# EAGLE design Orders (EAGLE 9.5.2)
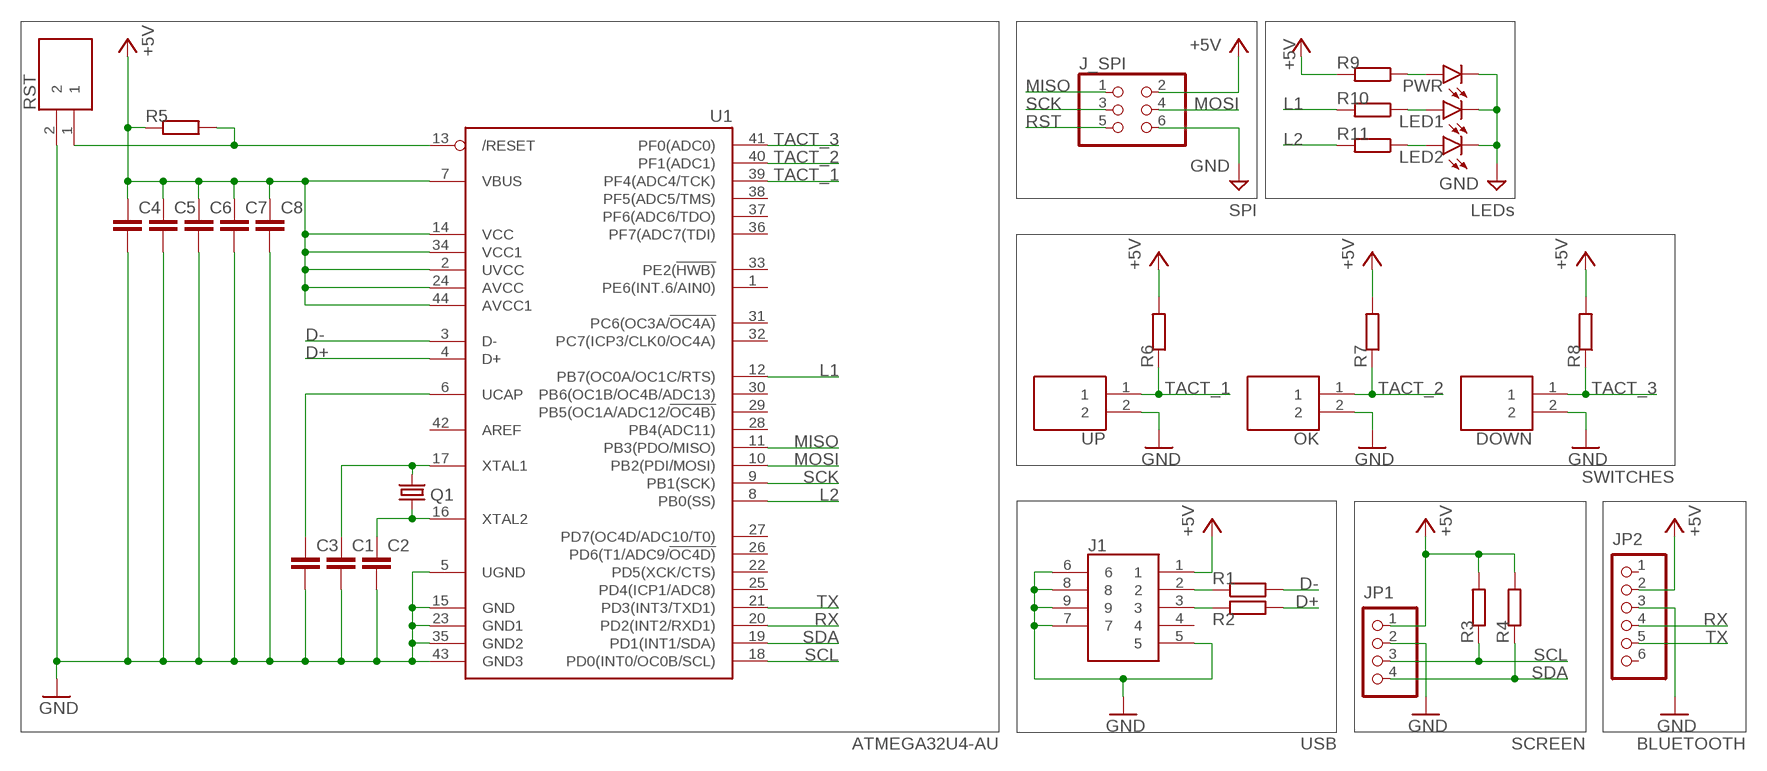
[diagram p0: schematic, sheet 1]

## Parts
C1  C-EUC1206  [C1206]
C2  C-EUC1206  [C1206]
C3  C-EUC1206  [C1206]
C4  C-EUC1206  [C1206]
C5  C-EUC1206  [C1206]
C6  C-EUC1206  [C1206]
C7  C-EUC1206  [C1206]
C8  C-EUC1206  [C1206]
DOWN  KSR231GLFS  [KSR]
J1  10104111-0001LF  [101041110001LF]
J_SPI  PINHD-2X3  [2X03]
JP1  PINHD-1X4  [1X04]
JP2  PINHD-1X6  [1X06]
LED1  LED3MM  [LED3MM]
LED2  LED3MM  [LED3MM]
OK  KSR231GLFS  [KSR]
PWR  LED3MM  [LED3MM]
Q1  CRYSTALHC49UP  [HC49UP]
R1  R-EU_R1206  [R1206]
R2  R-EU_R1206  [R1206]
R3  R-EU_R1206  [R1206]
R4  R-EU_R1206  [R1206]
R5  R-EU_R1206  [R1206]
R6  R-EU_R1206  [R1206]
R7  R-EU_R1206  [R1206]
R8  R-EU_R1206  [R1206]
R9  R-EU_R1206  [R1206]
R10  R-EU_R1206  [R1206]
R11  R-EU_R1206  [R1206]
RST  KSR231GLFS  [KSR]
U1  ATMEGA32U4-AU  [TQFP44]
UP  KSR231GLFS  [KSR]

## Nets
+5V: C4.1 C5.1 C6.1 C7.1 C8.1 J1.1 J_SPI.2 JP1.1 JP2.2 R3.2 R4.2 R5.1 R6.2 R7.2 R8.2 R9.2 U1.2(UVCC) U1.7(VBUS) U1.14(VCC) U1.24(AVCC) U1.34(VCC1) U1.44(AVCC1)
D+: R2.2 U1.4(D+)
D-: R1.2 U1.3(D-)
GND: C1.2 C2.2 C3.2 C4.2 C5.2 C6.2 C7.2 C8.2 DOWN.2 J1.5 J1.6 J1.7 J1.8 J1.9 J_SPI.6 JP1.2 JP2.3 LED1.K(C) LED2.K(C) OK.2 PWR.K(C) RST.2 U1.5(UGND) U1.15(GND) U1.23(GND1) U1.35(GND2) U1.43(GND3) UP.2
L1: R10.2 U1.12(PB7(OC0A/OC1C/RTS))
L2: R11.2 U1.8(PB0(SS))
MISO: J_SPI.1 U1.11(PB3(PDO/MISO))
MOSI: J_SPI.4 U1.10(PB2(PDI/MOSI))
N$1: J1.2 R1.1
N$2: J1.3 R2.1
N$3: C1.1 Q1.2 U1.17(XTAL1)
N$4: C2.1 Q1.1 U1.16(XTAL2)
N$5: PWR.A R9.1
N$6: LED1.A R10.1
N$7: LED2.A R11.1
RST: J_SPI.5 R5.2 RST.1 U1.13(/RESET)
RX: JP2.4 U1.20(PD2(INT2/RXD1))
SCK: J_SPI.3 U1.9(PB1(SCK))
SCL: JP1.3 R3.1 U1.18(PD0(INT0/OC0B/SCL))
SDA: JP1.4 R4.1 U1.19(PD1(INT1/SDA))
TACT_1: R6.1 U1.39(PF4(ADC4/TCK)) UP.1
TACT_2: OK.1 R7.1 U1.40(PF1(ADC1))
TACT_3: DOWN.1 R8.1 U1.41(PF0(ADC0))
TX: JP2.5 U1.21(PD3(INT3/TXD1))
UCAP: C3.1 U1.6(UCAP)
Unconnected: J1.4 JP2.1 JP2.6 U1.1(PE6(INT.6/AIN0)) U1.22(PD5(XCK/CTS)) U1.25(PD4(ICP1/ADC8)) U1.26(PD6(T1/ADC9/!OC4D)) U1.27(PD7(OC4D/ADC10/T0)) U1.28(PB4(ADC11)) U1.29(PB5(OC1A/ADC12/!OC4B)) U1.30(PB6(OC1B/OC4B/ADC13)) U1.31(PC6(OC3A/!OC4A)) U1.32(PC7(ICP3/CLK0/OC4A)) U1.33(PE2(!HWB)) U1.36(PF7(ADC7(TDI)) U1.37(PF6(ADC6/TDO)) U1.38(PF5(ADC5/TMS)) U1.42(AREF)

## Notes on the sheet
- SPI | LEDs
- SWITCHES
- USB | SCREEN | BLUETOOTH

## Library data of the parts
C1-C8 = rcl:C-EU: CAPACITOR, European symbol; SPICEPREFIX: C
DOWN OK RST UP = Switch:KSR231GLFS: Switch Tactile SMT gull wing 3.0N silver IP50 Tactile Switch, SPST-NO 50 mA dc 0.75mm Source: Datasheet <https://componentsearchengine.com/Datasheets/1/KSR231GLFS.pdf>; DESCRIPTION: Switch Tactile SMT gull wing 3.0N silver IP50 Tactile Switch, SPST-NO 50 mA dc 0.75mm; HEIGHT: mm; MANUFACTURER_NAME: C & K COMPONENTS; MANUFACTURER_PART_NUMBER: KSR231GLFS; MOUSER_PART_NUMBER: 611-KSR231GLFS; MOUSER_PRICE-STOCK: https://www.mouser.com/Search/Refine.aspx?Keyword=611-KSR231GLFS; RS_PART_NUMBER: 7931673P; RS_PRICE-STOCK: http://uk.rs-online.com/web/p/products/7931673P
J1 = USB:10104111-0001LF: USB Connectors 5P Quick Connect MicroUSB TypeAB Rcpt Source: Datasheet <https://cdn.amphenol-icc.com/media/wysiwyg/files/drawing/10104111.pdf>; ALLIED_NUMBER: 70236825; ALLIED_PRICE-STOCK: https://www.alliedelec.com/amphenolfci-10104111-0001lf/70236825/; DESCRIPTION: USB Connectors 5P Quick Connect MicroUSB TypeAB Rcpt; HEIGHT: 3.07mm; MANUFACTURER_NAME: Amphenol; MANUFACTURER_PART_NUMBER: 10104111-0001LF; MOUSER_PART_NUMBER: 649-10104111-0001LF; MOUSER_PRICE-STOCK: https://www.mouser.com/Search/Refine.aspx?Keyword=649-10104111-0001LF; RS_PART_NUMBER: 7142353; RS_PRICE-STOCK: http://uk.rs-online.com/web/p/products/7142353
J_SPI = pinhead:PINHD-2X3: PIN HEADER
JP1 = pinhead:PINHD-1X4: PIN HEADER
JP2 = pinhead:PINHD-1X6: PIN HEADER
LED1 LED2 PWR = led:LED: LED OSRAM: - CHIPLED LG R971, LG N971, LY N971, LG Q971, LY Q971, LO R971, LY R971 LH N974, LH R974 LS Q976, LO Q976, LY Q976 LO Q996 - Hyper CHIPLED LW Q18S LB Q993, LB Q99A, LB R99A - SideLED LS A670, LO A670, LY A670, LG A670, LP A670 LB A673, LV A673, LT A673, LW A673 LH A674 LY A675 LS A676, LA A676, LO A676, LY A676, LW A676 LS A679, LY A679, LG A679 - Hyper Micro SIDELED® LS Y876, LA Y876, LO Y876, LY Y876 LT Y87S - SmartLED LW L88C, LW L88S LB L89C, LB L89S, LG L890 LS L89K, LO L89K, LY L89K LS L896, LA L896, LO L896, LY L896 - TOPLED LS T670, LO T670, LY T670, LG T670, LP T670 LSG T670, LSP T670, LSY T670, LOP T670, LYG T670 LG T671, LOG T671, LSG T671 LB T673, LV T673, LT T673, LW T673 LH T674 LS T676, LA T676, LO T676, LY T676, LB T676, LH T676, LSB T676, LW T676 LB T67C, LV T67C, LT T67C, LS T67K, LO T67K, LY T67K, LW E67C LS E67B, LA E67B, LO E67B, LY E67B, LB E67C, LV E67C, LT E67C LW T67C LS T679, LY T679, LG T679 LS T770, LO T770, LY T770, LG T770, LP T770 LB T773, LV T773, LT T773, LW T773 LH T774 LS E675, LA E675, LY E675, LS T675 LS T776, LA T776, LO T776, LY T776, LB T776 LHGB T686 LT T68C, LB T68C - Hyper Mini TOPLED® LB M676 - Mini TOPLED Santana® LG M470 LS M47K, LO M47K, LY M47K Source: http://www.osram.convergy.de LUXEON: - LUMILED® LXK2-PW12-R00, LXK2-PW12-S00, LXK2-PW14-U00, LXK2-PW14-V00 LXK2-PM12-R00, LXK2-PM12-S00, LXK2-PM14-U00 LXK2-PE12-Q00, LXK2-PE12-R00, LXK2-PE12-S00, LXK2-PE14-T00, LXK2-PE14-U00 LXK2-PB12-K00, LXK2-PB12-L00, LXK2-PB12-M00, LXK2-PB14-N00, LXK2-PB14-P00, LXK2-PB14-Q00 LXK2-PR12-L00, LXK2-PR12-M00, LXK2-PR14-Q00, LXK2-PR14-R00 LXK2-PD12-Q00, LXK2-PD12-R00, LXK2-PD12-S00 LXK2-PH12-R00, LXK2-PH12-S00 LXK2-PL12-P00, LXK2-PL12-Q00, LXK2-PL12-R00 Source: www.luxeon.com KINGBRIGHT: KA-3528ASYC Source: www.kingbright.com
Q1 = adafruit:CRYSTAL: CRYSTAL; OC_FARNELL: unknown; OC_NEWARK: unknown
R1-R11 = rcl:R-EU_: RESISTOR, European symbol; SPICEPREFIX: R
U1 = adafruit:ATMEGA32U4: http://www.ladyada.net/library/eagle

## Board
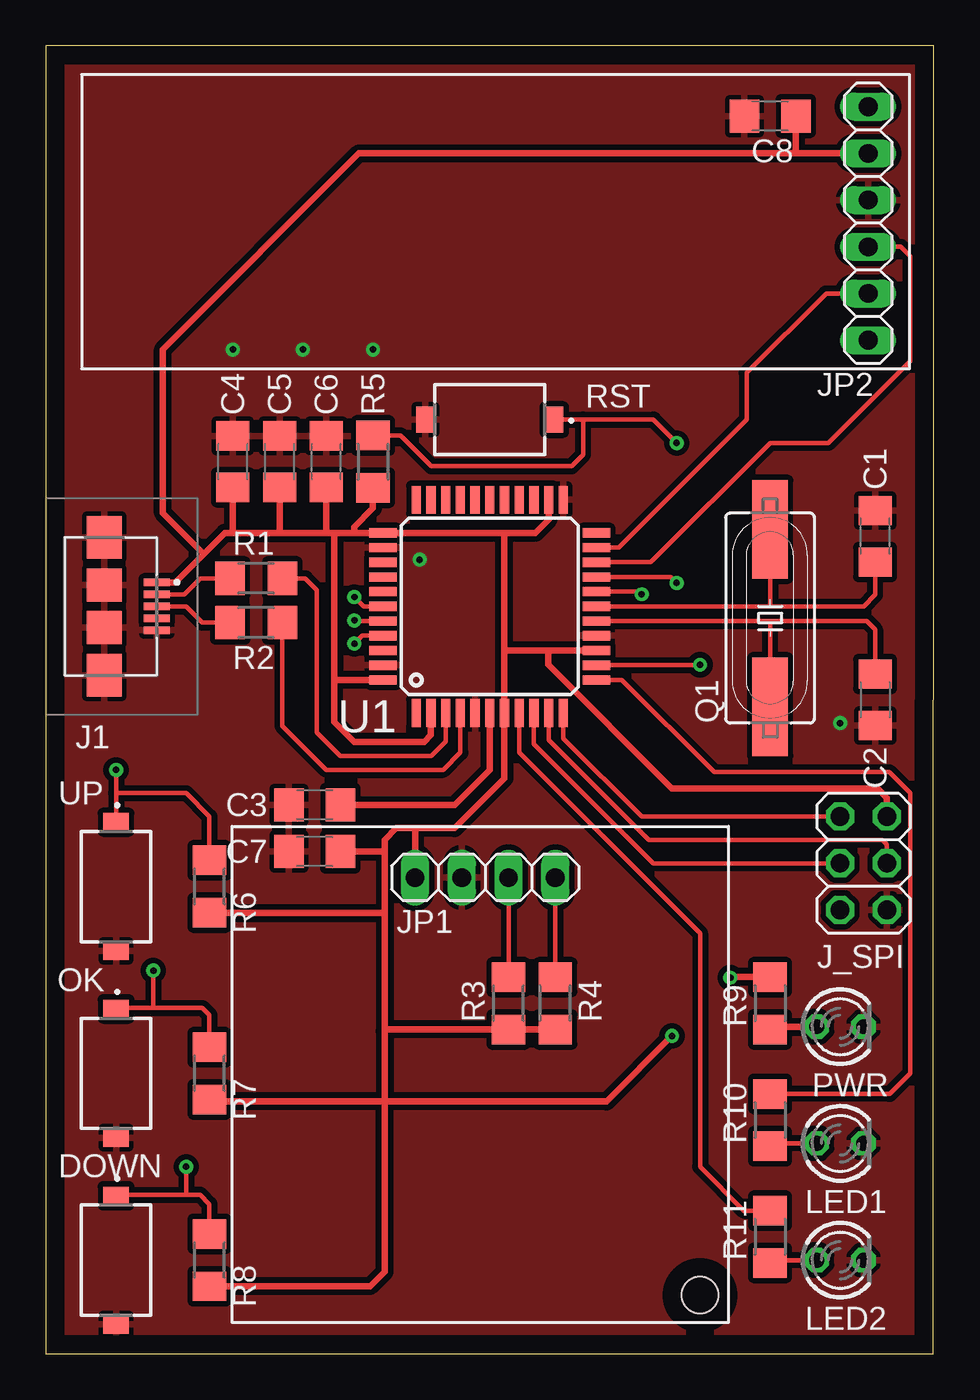
[diagram p1: board, top side]
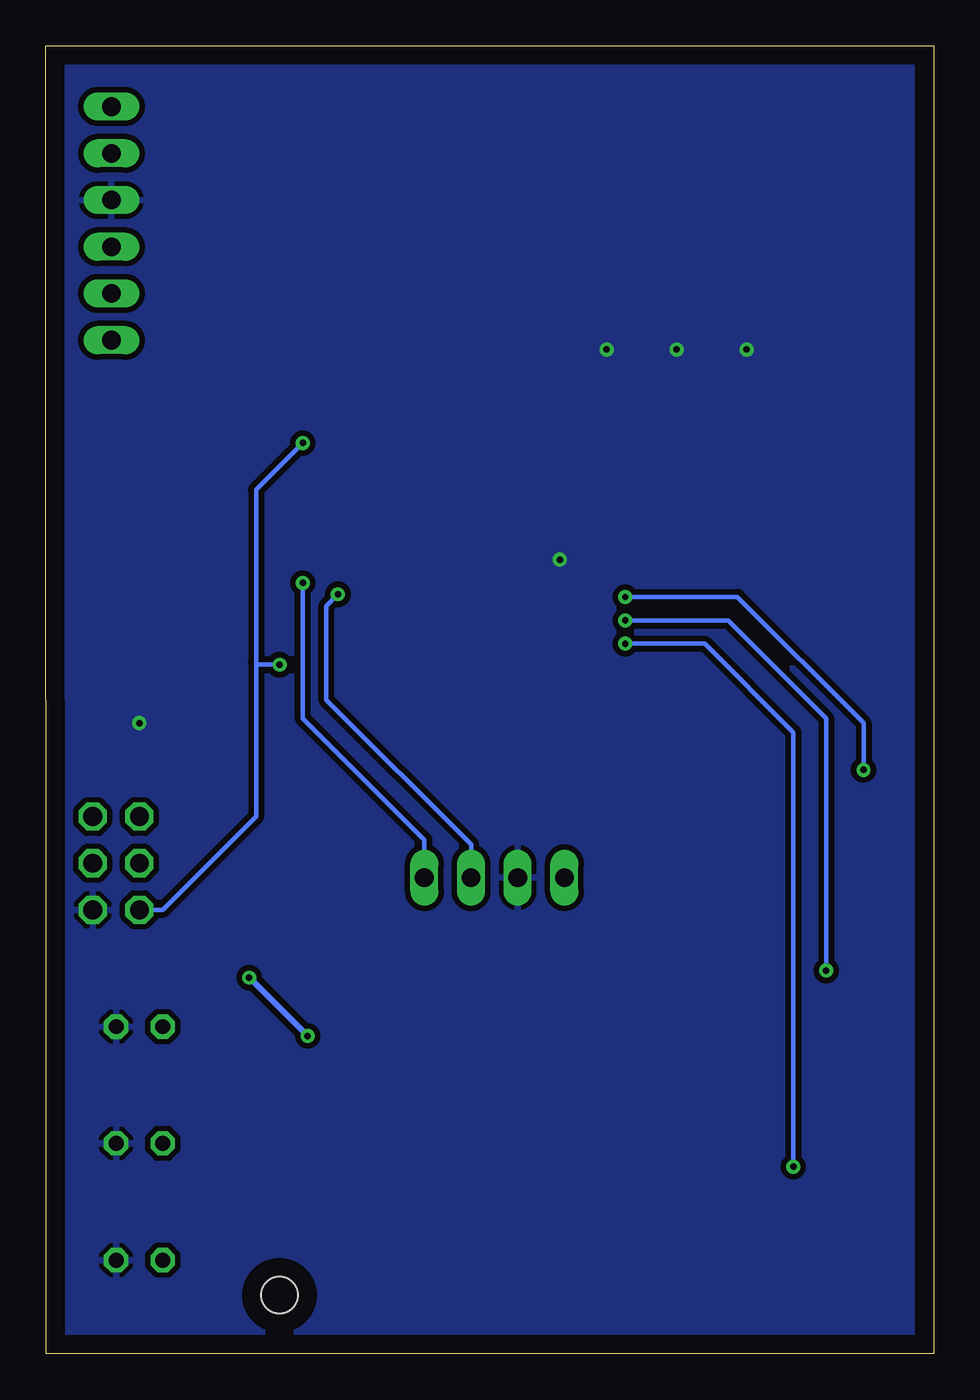
[diagram p2: board, bottom side, seen from below]

Size 48.26 x 71.12 mm. Coordinates in mm from the lower left corner, seen from the top.
Outline: 0,0 48.24,0 48.26,71.12 0,71.12 0,0
Copper layers (1*16): Top 0.035mm / dielectric 1.5mm / Bottom 0.035mm
Design rules "default": minimum track width 6mil, minimum drill 0.35mm, track to track 6mil, track to pad 6mil, pad to pad 6mil, via to via 6mil, smd to smd 6mil, copper to edge 40mil, drill to drill 6mil, minimum pad ring 10mil, minimum via ring 8mil, stop-mask expansion 4mil, vias tented up to drill 0mil, thermal gap 10mil
Holes 2 mm at 35.56,3.17

### Footprints (pad centres in the part's own frame; a part is rotated, then mirrored left to right if it is on the bottom)
C1206 = smd 1.6 x 1.8: 1 -1.4,0; 2 1.4,0
KSR = smd 1 x 1.4: 1 -3.5,0; 2 3.5,0
101041110001LF = smd 0.4 x 1.4: 1 -1.3,5; 2 -0.65,5; 3 0,5; 4 0.65,5; 5 1.3,5 | smd 2.3 x 1.9: 6 -3.75,2.15; 7 3.75,2.15 | smd 1.8 x 1.9: 8 -1.15,2.15; 9 1.15,2.15
2X03 = drill 1.016 octagon: 1 -2.54,-1.27; 2 -2.54,1.27; 3 0,-1.27; 4 0,1.27; 5 2.54,-1.27; 6 2.54,1.27
1X04 = drill 1.016 long: 1 -3.81,0; 2 -1.27,0; 3 1.27,0; 4 3.81,0
1X06 = drill 1.016 long: 1 -6.35,0; 2 -3.81,0; 3 -1.27,0; 4 1.27,0; 5 3.81,0; 6 6.35,0
LED3MM = drill 0.813 octagon: A -1.27,0; K 1.27,0
HC49UP = smd 5.334 x 1.93: 1 -4.826,0; 2 4.826,0
R1206 = smd 1.6 x 1.803: 1 -1.422,0; 2 1.422,0
TQFP44 = smd 1.5 x 0.5: 1 -5.8,4; 2 -5.8,3.2; 3 -5.8,2.4; 4 -5.8,1.6; 5 -5.8,0.8; 6 -5.8,0; 7 -5.8,-0.8; 8 -5.8,-1.6; 9 -5.8,-2.4; 10 -5.8,-3.2; 11 -5.8,-4; 23 5.8,-4; 24 5.8,-3.2; 25 5.8,-2.4; 26 5.8,-1.6; 27 5.8,-0.8; 28 5.8,0; 29 5.8,0.8; 30 5.8,1.6; 31 5.8,2.4; 32 5.8,3.2; 33 5.8,4 | smd 0.5 x 1.5: 12 -4,-5.8; 13 -3.2,-5.8; 14 -2.4,-5.8; 15 -1.6,-5.8; 16 -0.8,-5.8; 17 0,-5.8; 18 0.8,-5.8; 19 1.6,-5.8; 20 2.4,-5.8; 21 3.2,-5.8; 22 4,-5.8; 34 4,5.8; 35 3.2,5.8; 36 2.4,5.8; 37 1.6,5.8; 38 0.8,5.8; 39 0,5.8; 40 -0.8,5.8; 41 -1.6,5.8; 42 -2.4,5.8; 43 -3.2,5.8; 44 -4,5.8

### Placement (x,y rotation side)
C1  45.09,44.45 90 top
C2  45.09,35.56 270 top
C3  14.61,29.84 180 top
C4  10.16,48.51 90 top
C5  12.7,48.51 90 top
C6  15.24,48.51 90 top
C7  14.61,27.3 180 top
C8  39.37,67.31 180 top
DOWN  3.81,5.08 270 top
J1  1.02,40.64 270 top
J_SPI  44.45,26.67 270 top
JP1  23.88,25.89 0 top
JP2  44.7,61.47 270 top
LED1  43.18,11.43 0 top
LED2  43.18,5.08 0 top
OK  3.81,15.24 270 top
PWR  43.18,17.78 0 top
Q1  39.37,40.01 90 top
R1  11.43,42.16 0 top
R2  11.43,39.75 0 top
R3  25.15,19.05 270 top
R4  27.69,19.05 270 top
R5  17.78,48.51 90 top
R6  8.89,25.4 270 top
R7  8.89,15.24 270 top
R8  8.89,5.08 270 top
R9  39.37,19.05 90 top
R10  39.37,12.7 90 top
R11  39.37,6.35 90 top
RST  24.13,50.8 180 top
U1  24.13,40.64 90 top
UP  3.81,25.4 270 top

### Tracks (layer width: path | path; a pad name or v marks a point on that pad's centre or on a via)
+5V  (via drill 0.35)
  Top 0.356: J1.1 7.01,41.94 8.57,43.5 | 10.16,44.64 9.71,44.64 8.57,43.5 | 10.16,44.64 12.7,44.64 | 12.7,44.64 15.24,44.64 | 16.76,44.64 U1.34 24.89,44.64 | 16.76,44.64 15.68,44.64 | C4.1 10.16,44.64 | C5.1 12.7,44.64 | C6.1 15.24,44.64 | 15.68,44.64 15.68,36.58 | 15.68,36.58 15.68,34.35 16.76,33.27 20.57,33.27 20.93,33.63 U1.2 | R5.1 17.78,45.97 16.76,44.96 16.76,44.64 | 15.68,36.58 15.75,36.64 U1.44 | 15.24,44.64 15.68,44.64 | U1.24 27.33,45.36 26.61,44.64 24.89,44.64 | 24.93,38.23 U1.7 24.93,31.28 22.23,28.57 20.07,28.57 | 24.93,38.23 24.93,44.6 24.89,44.64 | U1.14 27.3,38.24 | 27.3,38.24 24.94,38.24 24.93,38.23 | J_SPI.2 45.72,30.23 45.21,30.73 34.04,30.73 27.3,37.47 27.3,38.24 | 18.41,27.3 18.41,27.94 19.05,28.57 20.07,28.57 | 18.41,27.3 18.41,23.88 | JP1.1 20.07,28.57 | C7.1 18.41,27.3 | R6.2 18.31,23.98 18.41,23.88 | R8.2 17.63,3.66 18.41,4.45 18.41,13.72 | 18.41,23.88 18.41,17.53 | 18.41,17.53 18.41,13.72 | R4.2 R3.2 18.52,17.63 18.41,17.53 | 8.57,43.5 6.35,45.72 6.35,54.61 17.02,65.28 40.77,65.28 | 40.77,65.28 JP2.2 | C8.1 40.77,65.28 | R9.2 37.24,20.47 v37.21,20.45 | v34.04,17.27 30.48,13.72 18.41,13.72 | 18.41,13.72 8.99,13.72 R7.2
  Bottom 0.356: v37.21,20.45 v34.04,17.27
D+
  Top 0.254: R2.2 12.85,34.14 15.24,31.75 21.59,31.75 22.53,32.69 U1.4
D-
  Top 0.254: R1.2 14.1,42.16 14.73,41.53 14.73,33.78 16,32.51 20.95,32.51 21.73,33.29 U1.3
GND  (via drill 0.35)
  other vias: 43.18,34.29 20.32,43.18 10.16,54.61 13.97,54.61 17.78,54.61
  pour Top (isolate 0.305): -0.64,71.75 48.9,71.75 48.9,-0.64 -0.64,-0.64
  pour Bottom (isolate 0.305): -1.27,72.39 49.53,72.39 49.53,-1.27 -1.27,-1.27
L1
  Top 0.254: U1.12 31.3,36.64 36.32,31.62 45.85,31.62 46.99,30.48 46.99,15.24 45.87,14.12 R10.2
L2
  Top 0.254: U1.8 25.73,32.69 35.56,22.86 35.56,10.16 37.95,7.77 R11.2
MISO
  Top 0.254: J_SPI.1 32.38,29.21 28.13,33.47 U1.11
MOSI
  Top 0.254: U1.10 27.33,33.38 32.77,27.94 45.47,27.94 45.72,27.69 J_SPI.4
N$1
  Top 0.254: J1.2 7.51,41.29 8.38,42.16 R1.1
N$2
  Top 0.254: J1.3 7.62,40.64 8.51,39.75 R2.1
N$3
  Top 0.254: U1.17 39.37,40.64 | 39.37,40.64 44.45,40.64 45.09,41.27 C1.1 | Q1.2 39.37,40.64
N$4
  Top 0.254: U1.16 39.37,39.84 | 39.37,39.84 44.62,39.84 45.09,39.37 C2.1 | Q1.1 39.37,39.84
N$5
  Top 0.356: R9.1 39.52,17.78 PWR.A
N$6
  Top 0.254: LED1.A 39.52,11.43 R10.1
N$7
  Top 0.254: LED2.A 39.52,5.08 R11.1
RST  (via drill 0.35)
  Top 0.254: v34.29,49.53 33.02,50.8 29.21,50.8 | U1.13 35.53,37.44 v35.56,37.47 | RST.1 29.21,50.8 | R5.2 19.28,49.94 20.95,48.26 28.57,48.26 29.21,48.9 29.21,50.8
  Bottom 0.254: J_SPI.5 41.91,24.13 36.83,29.21 36.83,37.59 | v34.29,49.53 36.83,46.99 36.83,37.59 | v35.56,37.47 36.7,37.47 36.83,37.59
RX
  Top 0.254: U1.20 32.88,43.04 39.37,49.53 42.55,49.53 46.99,53.98 46.99,59.69 46.48,60.2 JP2.4
SCK
  Top 0.254: J_SPI.3 33.02,26.67 26.53,33.16 U1.9
SCL  (via drill 0.35)
  Top 0.254: U1.18 32.24,41.44 v32.38,41.3 | R3.1 JP1.3
  Bottom 0.254: JP1.3 25.15,27.69 33.02,35.56 33.02,40.66 v32.38,41.3
SDA  (via drill 0.35)
  Top 0.254: U1.19 33.96,42.24 v34.29,41.91 | JP1.4 R4.1
  Bottom 0.254: v34.29,41.91 34.29,34.54 27.69,27.94 JP1.4
TACT_1  (via drill 0.35)
  Top 0.254: v3.81,31.75 3.81,30.48 | 3.81,30.48 UP.1 | 3.81,30.48 7.62,30.48 8.89,29.21 R6.1 | U1.39 17.27,40.64 v16.76,41.15
  Bottom 0.254: v16.76,41.15 10.67,41.15 3.81,34.29 v3.81,31.75
TACT_2  (via drill 0.35)
  Top 0.254: U1.40 16.8,39.84 v16.76,39.88 | v5.84,20.83 5.84,18.8 | R7.1 8.89,18.41 8.51,18.8 5.84,18.8 | OK.1 3.87,18.8 5.84,18.8
  Bottom 0.254: v16.76,39.88 11.18,39.88 5.84,34.54 v5.84,20.83
TACT_3  (via drill 0.35)
  Top 0.254: U1.41 17.2,39.04 v16.76,38.61 | v7.62,10.16 7.62,8.64 | DOWN.1 3.87,8.64 7.62,8.64 | 7.62,8.64 8.38,8.64 8.89,8.13 R8.1
  Bottom 0.254: v16.76,38.61 12.45,38.61 7.62,33.78 v7.62,10.16
TX
  Top 0.254: JP2.5 42.42,57.66 38.1,53.34 38.1,50.8 31.14,43.84 U1.21
UCAP
  Top 0.356: C3.1 22.23,29.84 24.13,31.75 U1.6